# EAGLE design Transponder Proaut V2 (EAGLE 7.7.0)
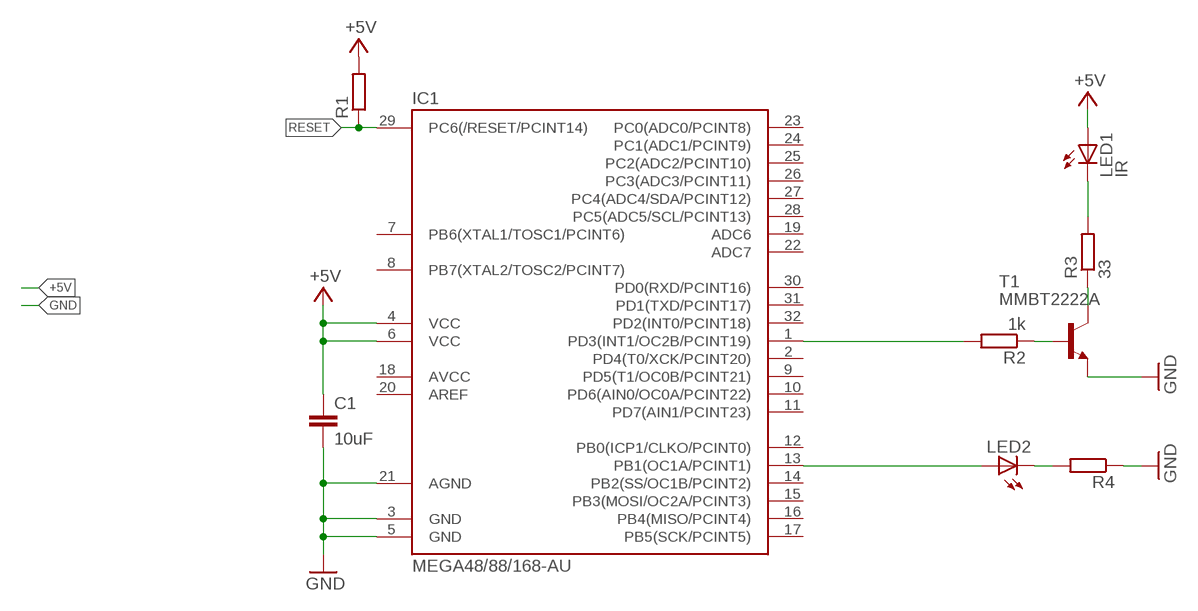
[diagram p0: schematic, sheet 1]

## Parts
C1  10uF  C-EUC0805  [C0805]
IC1  MEGA48/88/168-AU  [TQFP32-08]
LED1  IR  LED5MM  [LED5MM]
LED2  LEDSML1206  [SML1206]
R1  R-EU_R0805  [R0805@1]
R2  1k  R-EU_R0805  [R0805@1]
R3  33  R-EU_R0805  [R0805@1]
R4  R-EU_R0805  [R0805@1]
T1  MMBT2222A  MMBT2222ALT1-NPN-SOT23-BEC  [SOT23-BEC]

## Nets
+5V: C1.1 IC1.4(VCC) IC1.6(VCC) LED1.A R1.2
GND [POWER]: C1.2 IC1.3(GND) IC1.5(GND) IC1.21(AGND) R4.1 T1.E
IR_LED: IC1.1(PD3(INT1/OC2B/PCINT19)) R2.2
N$2: LED1.K(C) R3.2
N$3: R3.1 T1.C
N$4: R2.1 T1.B
N$5: IC1.13(PB1(OC1A/PCINT1)) LED2.A
N$6: LED2.C R4.2
RESET: IC1.29(PC6(/RESET/PCINT14)) R1.1
Unconnected: IC1.2(PD4(T0/XCK/PCINT20)) IC1.7(PB6(XTAL1/TOSC1/PCINT6)) IC1.8(PB7(XTAL2/TOSC2/PCINT7)) IC1.9(PD5(T1/OC0B/PCINT21)) IC1.10(PD6(AIN0/OC0A/PCINT22)) IC1.11(PD7(AIN1/PCINT23)) IC1.12(PB0(ICP1/CLKO/PCINT0)) IC1.14(PB2(SS/OC1B/PCINT2)) IC1.15(PB3(MOSI/OC2A/PCINT3)) IC1.16(PB4(MISO/PCINT4)) IC1.17(PB5(SCK/PCINT5)) IC1.18(AVCC) IC1.19(ADC6) IC1.20(AREF) IC1.22(ADC7) IC1.23(PC0(ADC0/PCINT8)) IC1.24(PC1(ADC1/PCINT9)) IC1.25(PC2(ADC2/PCINT10)) IC1.26(PC3(ADC3/PCINT11)) IC1.27(PC4(ADC4/SDA/PCINT12)) IC1.28(PC5(ADC5/SCL/PCINT13)) IC1.30(PD0(RXD/PCINT16)) IC1.31(PD1(TXD/PCINT17)) IC1.32(PD2(INT0/PCINT18))

## Library data of the parts
C1 = rcl:C-EU: CAPACITOR, European symbol
IC1 = avr-6:MEGA48/88/168
LED1 LED2 = led:LED: LED OSRAM: - CHIPLED LG R971, LG N971, LY N971, LG Q971, LY Q971, LO R971, LY R971 LH N974, LH R974 LS Q976, LO Q976, LY Q976 LO Q996 - Hyper CHIPLED LW Q18S LB Q993, LB Q99A, LB R99A - SideLED LS A670, LO A670, LY A670, LG A670, LP A670 LB A673, LV A673, LT A673, LW A673 LH A674 LY A675 LS A676, LA A676, LO A676, LY A676, LW A676 LS A679, LY A679, LG A679 - Hyper Micro SIDELED® LS Y876, LA Y876, LO Y876, LY Y876 LT Y87S - SmartLED LW L88C, LW L88S LB L89C, LB L89S, LG L890 LS L89K, LO L89K, LY L89K LS L896, LA L896, LO L896, LY L896 - TOPLED LS T670, LO T670, LY T670, LG T670, LP T670 LSG T670, LSP T670, LSY T670, LOP T670, LYG T670 LG T671, LOG T671, LSG T671 LB T673, LV T673, LT T673, LW T673 LH T674 LS T676, LA T676, LO T676, LY T676, LB T676, LH T676, LSB T676, LW T676 LB T67C, LV T67C, LT T67C, LS T67K, LO T67K, LY T67K, LW E67C LS E67B, LA E67B, LO E67B, LY E67B, LB E67C, LV E67C, LT E67C LW T67C LS T679, LY T679, LG T679 LS T770, LO T770, LY T770, LG T770, LP T770 LB T773, LV T773, LT T773, LW T773 LH T774 LS E675, LA E675, LY E675, LS T675 LS T776, LA T776, LO T776, LY T776, LB T776 LHGB T686 LT T68C, LB T68C - Hyper Mini TOPLED® LB M676 - Mini TOPLED Santana® LG M470 LS M47K, LO M47K, LY M47K Source: http://www.osram.convergy.de LUXEON: - LUMILED® LXK2-PW12-R00, LXK2-PW12-S00, LXK2-PW14-U00, LXK2-PW14-V00 LXK2-PM12-R00, LXK2-PM12-S00, LXK2-PM14-U00 LXK2-PE12-Q00, LXK2-PE12-R00, LXK2-PE12-S00, LXK2-PE14-T00, LXK2-PE14-U00 LXK2-PB12-K00, LXK2-PB12-L00, LXK2-PB12-M00, LXK2-PB14-N00, LXK2-PB14-P00, LXK2-PB14-Q00 LXK2-PR12-L00, LXK2-PR12-M00, LXK2-PR14-Q00, LXK2-PR14-R00 LXK2-PD12-Q00, LXK2-PD12-R00, LXK2-PD12-S00 LXK2-PH12-R00, LXK2-PH12-S00 LXK2-PL12-P00, LXK2-PL12-Q00, LXK2-PL12-R00 Source: www.luxeon.com KINGBRIGHT: KA-3528ASYC Source: www.kingbright.com
R1-R4 = rcl:R-EU_: RESISTOR, European symbol
T1 = transistor:*-NPN-: NPN Transistror BF959 corrected 2008.03.06

## Net classes
1 POWER: width 0.508 mm, clearance 0.102 mm

## Board
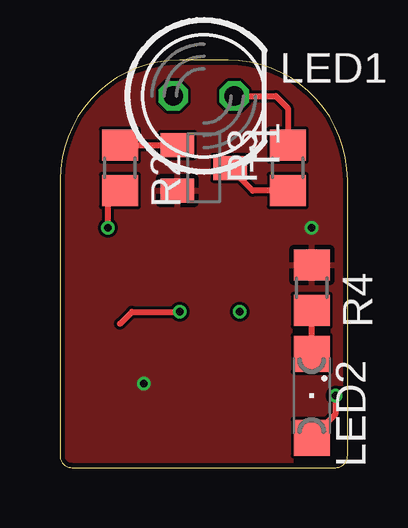
[diagram p1: board, top side]
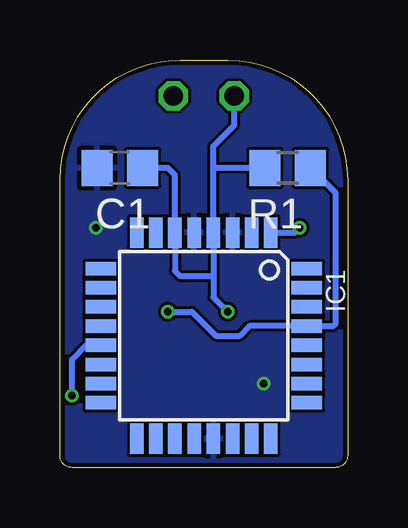
[diagram p2: board, bottom side, seen from below]

Size 12 x 17 mm. Coordinates in mm from the lower left corner, seen from the top.
Outline: 0,12 0,0.5 arc90 0.5,0 11.5,0 arc90 12,0.5 12,12 arc90 7,17 5,17 arc90 0,12
Copper layers (1*16): Top 0.018mm / dielectric 1.55mm / Bottom 0.018mm
Design rules "Multi-CB_2L_125um-Tracks_OL35um": minimum track width 0.125mm, minimum drill 0.2mm, track to track 0.125mm, track to pad 0.125mm, pad to pad 0.125mm, via to via 0.125mm, smd to smd 0mil, copper to edge 0.2mm, drill to drill 0.2mm, minimum pad ring 0.125mm, minimum via ring 0.125mm, stop-mask expansion 2mil, vias tented up to drill 0.45mm, thermal gap 0.2mm

### Footprints (pad centres in the part's own frame; a part is rotated, then mirrored left to right if it is on the bottom)
C0805 = smd 1.3 x 1.5: 1 -0.95,0; 2 0.95,0
TQFP32-08 = smd 1.27 x 0.559: 1 -4.293,2.8; 2 -4.293,2; 3 -4.293,1.2; 4 -4.293,0.4; 5 -4.293,-0.4; 6 -4.293,-1.2; 7 -4.293,-2; 8 -4.293,-2.8; 17 4.293,-2.8; 18 4.293,-2; 19 4.293,-1.2; 20 4.293,-0.4; 21 4.293,0.4; 22 4.293,1.2; 23 4.293,2; 24 4.293,2.8 | smd 0.559 x 1.27: 9 -2.8,-4.293; 10 -2,-4.293; 11 -1.2,-4.293; 12 -0.4,-4.293; 13 0.4,-4.293; 14 1.2,-4.293; 15 2,-4.293; 16 2.8,-4.293; 25 2.8,4.293; 26 2,4.293; 27 1.2,4.293; 28 0.4,4.293; 29 -0.4,4.293; 30 -1.2,4.293; 31 -2,4.293; 32 -2.8,4.293
LED5MM = drill 0.813 octagon: A -1.27,0; K 1.27,0
SML1206 = smd 1.5 x 1.5: A 1.75,0; C -1.75,0
R0805@1 = smd 1.3 x 1.5: 1 -0.95,0; 2 0.95,0
SOT23-BEC = smd 1 x 1.4: B -0.95,-1.1; C 0,1.1; E 0.95,-1.1

### Placement (x,y rotation side)
C1  9.5,12.5 180 bottom
IC1  6,5.5 270 bottom
LED1  6,15.5 0 top
LED2  10.5,3 270 top
R1  2.5,12.5 180 bottom
R2  2.5,12.5 270 top
R3  9.5,12.5 90 top
R4  10.5,7.5 270 top
T1  6,12.5 270 top

### Tracks (layer width: path | path; a pad name or v marks a point on that pad's centre or on a via)
+5V  (via drill 0.3)
  Top 0.254: 2.5,6 3,6.5 v5,6.5
  Bottom 0.254: 5.6,8 IC1.4 5.6,12.5 | 5.6,12.5 5.6,13.4 4.73,14.27 LED1.A | R1.2 5.6,12.5 | C1.1 7.5,12.5 7.2,12.2 IC1.6 7.2,8.2 7,8 5.6,8 | 5.6,8 5.6,7.1 v5,6.5
GND  (via drill 0.3)
  other vias: 3.5,3.5 10.5,10
  pour Top: -0.5,-0.5 12.5,-0.5 12.5,17.5 -0.5,17.5
  pour Bottom: -0.5,-0.5 12.5,-0.5 12.5,17.5 -0.5,17.5
IR_LED  (via drill 0.3)
  Top 0.254: v2,10 2,11.05 R2.2
  Bottom 0.254: IC1.1 2.21,9.79 v2,10
N$2
  Top 0.254: LED1.K 9,15.5 9.5,15 R3.2
N$3
  Top 0.254: R3.1 8.05,11.55 T1.C
N$4
  Top 0.254: R2.1 T1.B
N$5  (via drill 0.3)
  Top 0.254: LED2.A 11.5,2.25 v11.5,3
  Bottom 0.254: v11.5,3 11.5,4.5 10.9,5.1 IC1.13
N$6
  Top 0.254: LED2.C R4.2
RESET  (via drill 0.3)
  Bottom 0.254: R1.1 0.5,11.45 0.5,6 0.6,5.9 IC1.29 4.1,5.9 4.5,5.5 5.5,5.5 6.5,6.5 v7.5,6.5